# EAGLE design balancing_bot_shield (EAGLE 9.6.2)
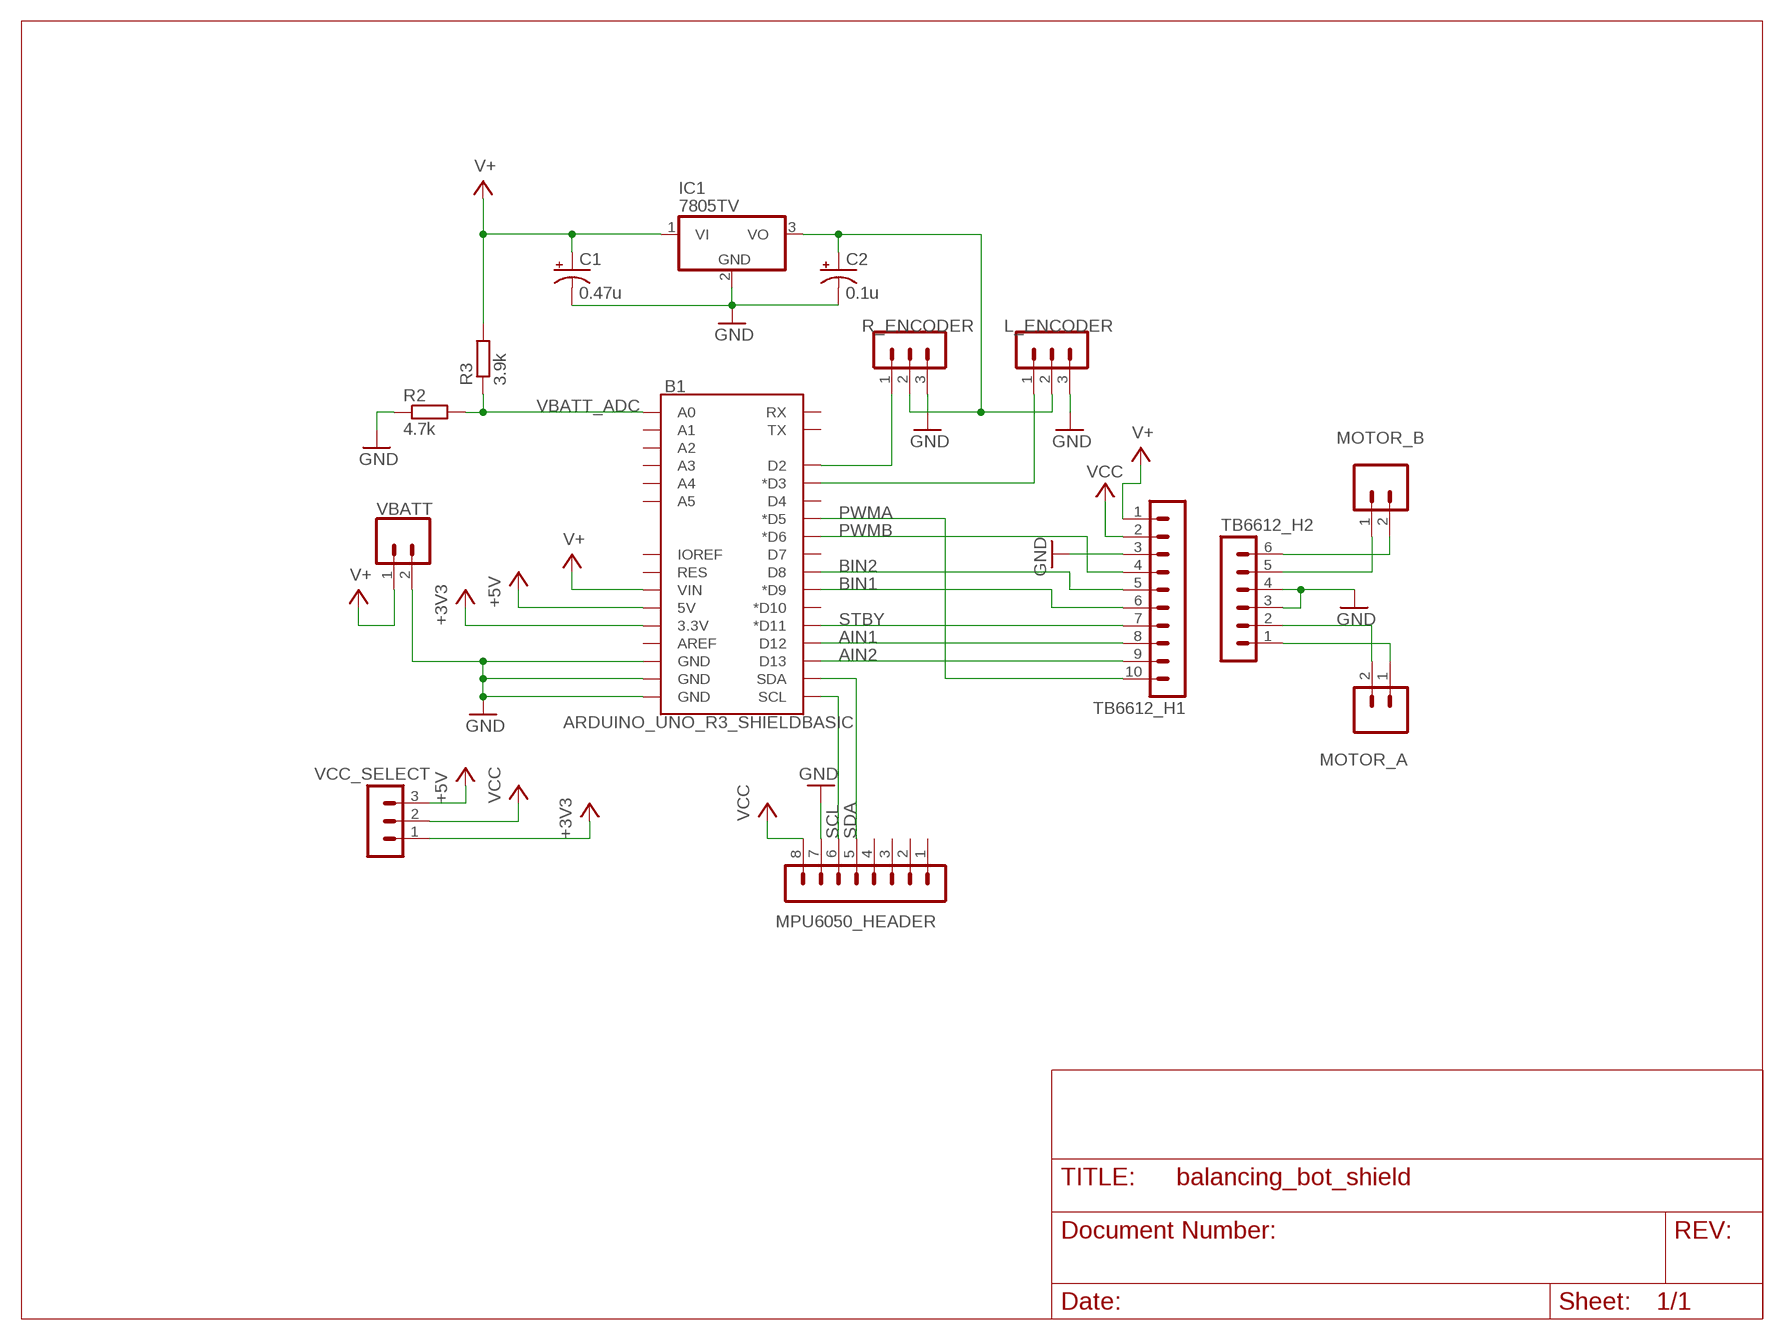
[diagram p0: schematic, sheet 1]

## Parts
B1  ARDUINO_UNO_R3_SHIELDBASIC  [UNO_R3_SHIELD]
C1  0.47u  CPOL-USE5-5  [E5-5]
C2  0.1u  CPOL-USE5-5  [E5-5]
IC1  7805TV  [TO220V]
L_ENCODER  MA03-1  [MA03-1]
MOTOR_A  CONN_025MM  [SCREWTERMINAL-5MM-2]
MOTOR_B  CONN_025MM  [SCREWTERMINAL-5MM-2]
MPU6050_HEADER  MA08-1  [MA08-1]
R2  4.7k  R-EU_0207/10  [0207/10]
R3  3.9k  R-EU_0207/10  [0207/10]
R_ENCODER  MA03-1  [MA03-1]
TB6612_H1  MA10-1  [MA10-1]
TB6612_H2  MA06-1  [MA06-1]
VBATT  CONN_025MM  [SCREWTERMINAL-5MM-2]
VCC_SELECT  MA03-1  [MA03-1]

## Nets
+3V3: B1.3.3V VCC_SELECT.1
+5V: B1.5V VCC_SELECT.3
AIN1: B1.D12 TB6612_H1.8
AIN2: B1.D13 TB6612_H1.9
BIN1: B1.D9(*D9) TB6612_H1.6
BIN2: B1.D8 TB6612_H1.5
GND: B1.GND@0(GND) B1.GND@1(GND) B1.GND@2(GND) C1.- C2.- IC1.2(GND) L_ENCODER.3 MPU6050_HEADER.7 R2.1 R_ENCODER.3 TB6612_H1.3 TB6612_H2.3 TB6612_H2.4 VBATT.2
N$1: B1.D2 R_ENCODER.1
N$2: B1.D3(*D3) L_ENCODER.1
N$3: MOTOR_B.2 TB6612_H2.6
N$4: MOTOR_B.1 TB6612_H2.5
N$5: MOTOR_A.2 TB6612_H2.2
N$6: MOTOR_A.1 TB6612_H2.1
N$7: C2.+ IC1.3(VO) L_ENCODER.2 R_ENCODER.2
PWMA: B1.D5(*D5) TB6612_H1.10
PWMB: B1.D6(*D6) TB6612_H1.4
SCL: B1.SCL MPU6050_HEADER.6
SDA: B1.SDA MPU6050_HEADER.5
STBY: B1.D11(*D11) TB6612_H1.7
V+: B1.VIN C1.+ IC1.1(VI) R3.2 TB6612_H1.1 VBATT.1
VBATT_ADC: B1.A0 R2.2 R3.1
VCC: MPU6050_HEADER.8 TB6612_H1.2 VCC_SELECT.2
Unconnected: B1.A1 B1.A2 B1.A3 B1.A4 B1.A5 B1.AREF B1.D4 B1.D7 B1.D10(*D10) B1.IOREF B1.RES B1.RX B1.TX MPU6050_HEADER.1 MPU6050_HEADER.2 MPU6050_HEADER.3 MPU6050_HEADER.4

## Library data of the parts
B1 = SparkFun-Boards:ARDUINO_UNO_R3_SHIELD: Arduino R3 Shield Footprint Shield form compatible with the Arduino Uno R3. SparkFun Products: MG2639 Cellular Shield <https://www.sparkfun.com/products/13120> MIDI Shield <https://www.sparkfun.com/products/12898> R3 Stackable Headers Kit <https://www.sparkfun.com/products/11417>
C1 C2 = rcl:CPOL-US: POLARIZED CAPACITOR, American symbol; SPICEPREFIX: C
IC1 = linear:78*: Positive VOLTAGE REGULATOR Source: http://cache.national.com/ds/LM/LM78L05.pdf http://www.fairchildsemi.com/ds/LM/LM7805.pdf
L_ENCODER R_ENCODER VCC_SELECT = con-lstb:MA03-1: PIN HEADER; OC_FARNELL: unknown; OC_NEWARK: unknown
MOTOR_A MOTOR_B VBATT = SparkFun-Connectors:CONN_02: Multi connection point. Often used as Generic Header-pin footprint for 0.1 inch spaced/style header connections On any of the 0.1 inch spaced packages, you can populate with these: Break Away Headers - Straight <https://www.sparkfun.com/products/116> (PRT-00116) Break Away Male Headers - Right Angle <https://www.sparkfun.com/products/553> (PRT-00553) Female Headers <https://www.sparkfun.com/products/115> (PRT-00115) Break Away Headers - Machine Pin <https://www.sparkfun.com/products/117> (PRT-00117) Break Away Female Headers - Swiss Machine Pin <https://www.sparkfun.com/products/743> (PRT-00743) For SCREWTERMINALS and SPRING TERMINALS visit here: Screw Terimnals on SparkFun.com <https://www.sparkfun.com/search/results?term=Screw+Terminals> (5mm/3.5mm/2.54mm spacing) This device is also useful as a general connection point to wire up your design to another part of your project. Our various solder wires solder well into these plated through hole pads. Hook-Up Wire - Assortment (Stranded, 22 AWG) <https://www.sparkfun.com/products/11375> (PRT-11375) Hook-Up Wire - Assortment (Solid Core, 22 AWG) <https://www.sparkfun.com/products/11367> (PRT-11367) View the entire wire category on our website here <https://www.sparkfun.com/categories/141> Special notes: Molex polarized connector foot print use with: PRT-08233 with associated crimp pins and housings. 2.54_SCREWTERM for use with PRT-10571. 3.5mm Screw Terminal footprints for PRT-08084 5mm Screw Terminal footprints for use with PRT-08432; SF_SKU: PRT-08432
MPU6050_HEADER = con-lstb:MA08-1: PIN HEADER; OC_FARNELL: unknown; OC_NEWARK: unknown
R2 R3 = rcl:R-EU_: RESISTOR, European symbol; SPICEPREFIX: R
TB6612_H1 = con-lstb:MA10-1: PIN HEADER; OC_FARNELL: unknown; OC_NEWARK: unknown
TB6612_H2 = con-lstb:MA06-1: PIN HEADER; OC_FARNELL: unknown; OC_NEWARK: unknown

## Board
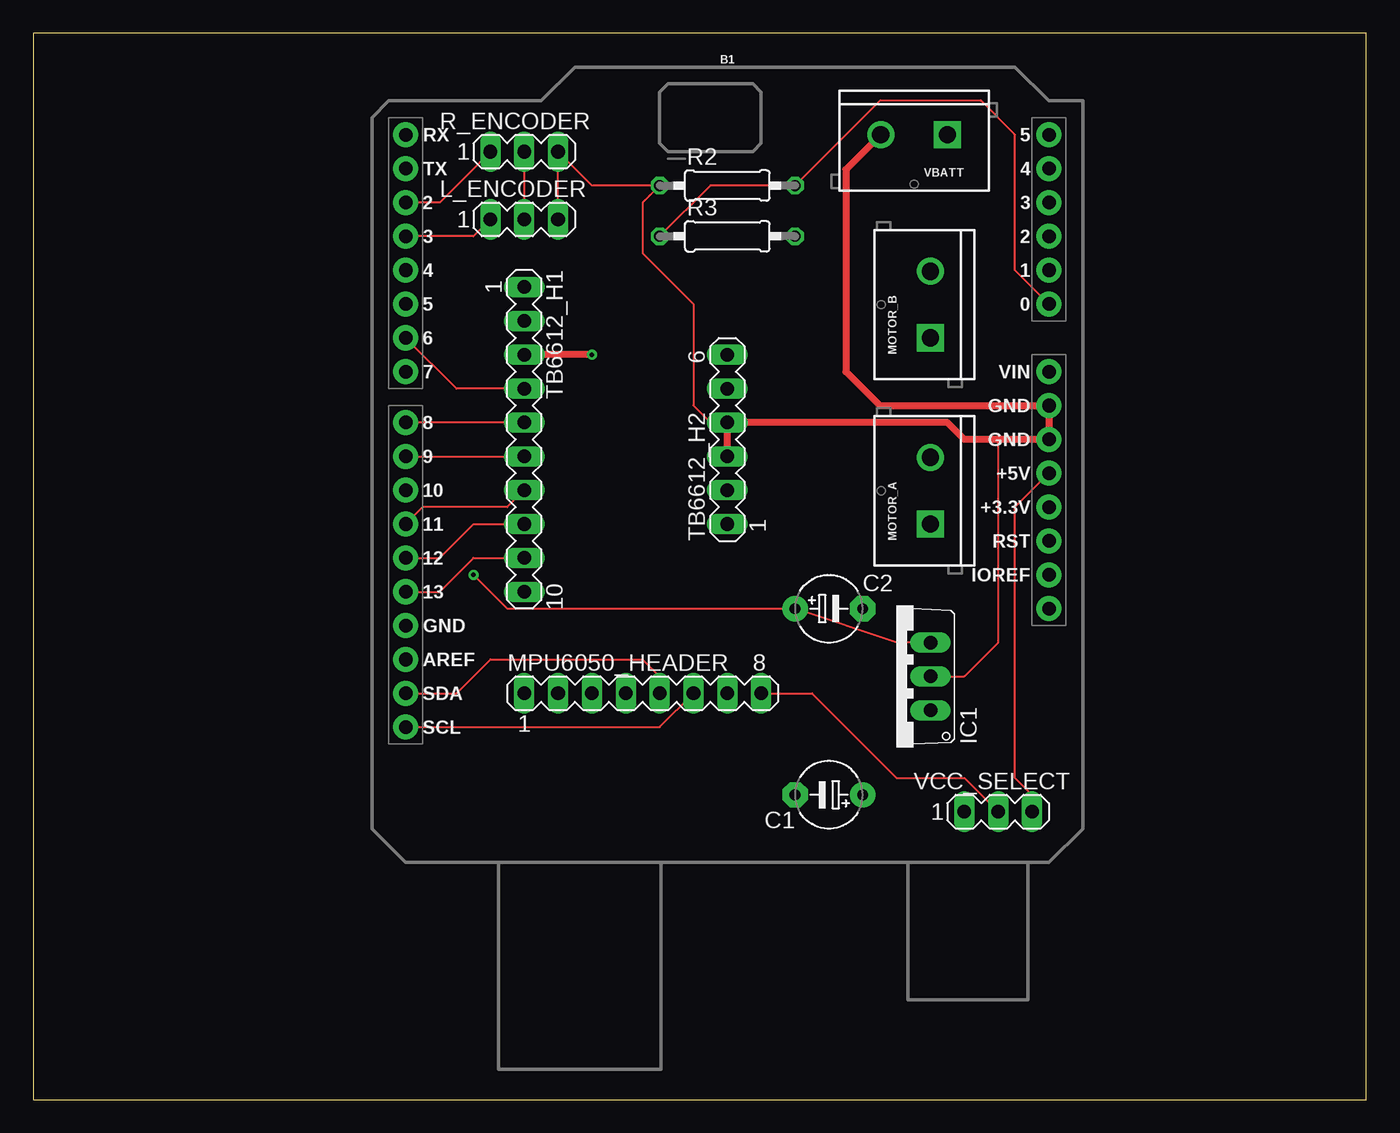
[diagram p1: board, top side]
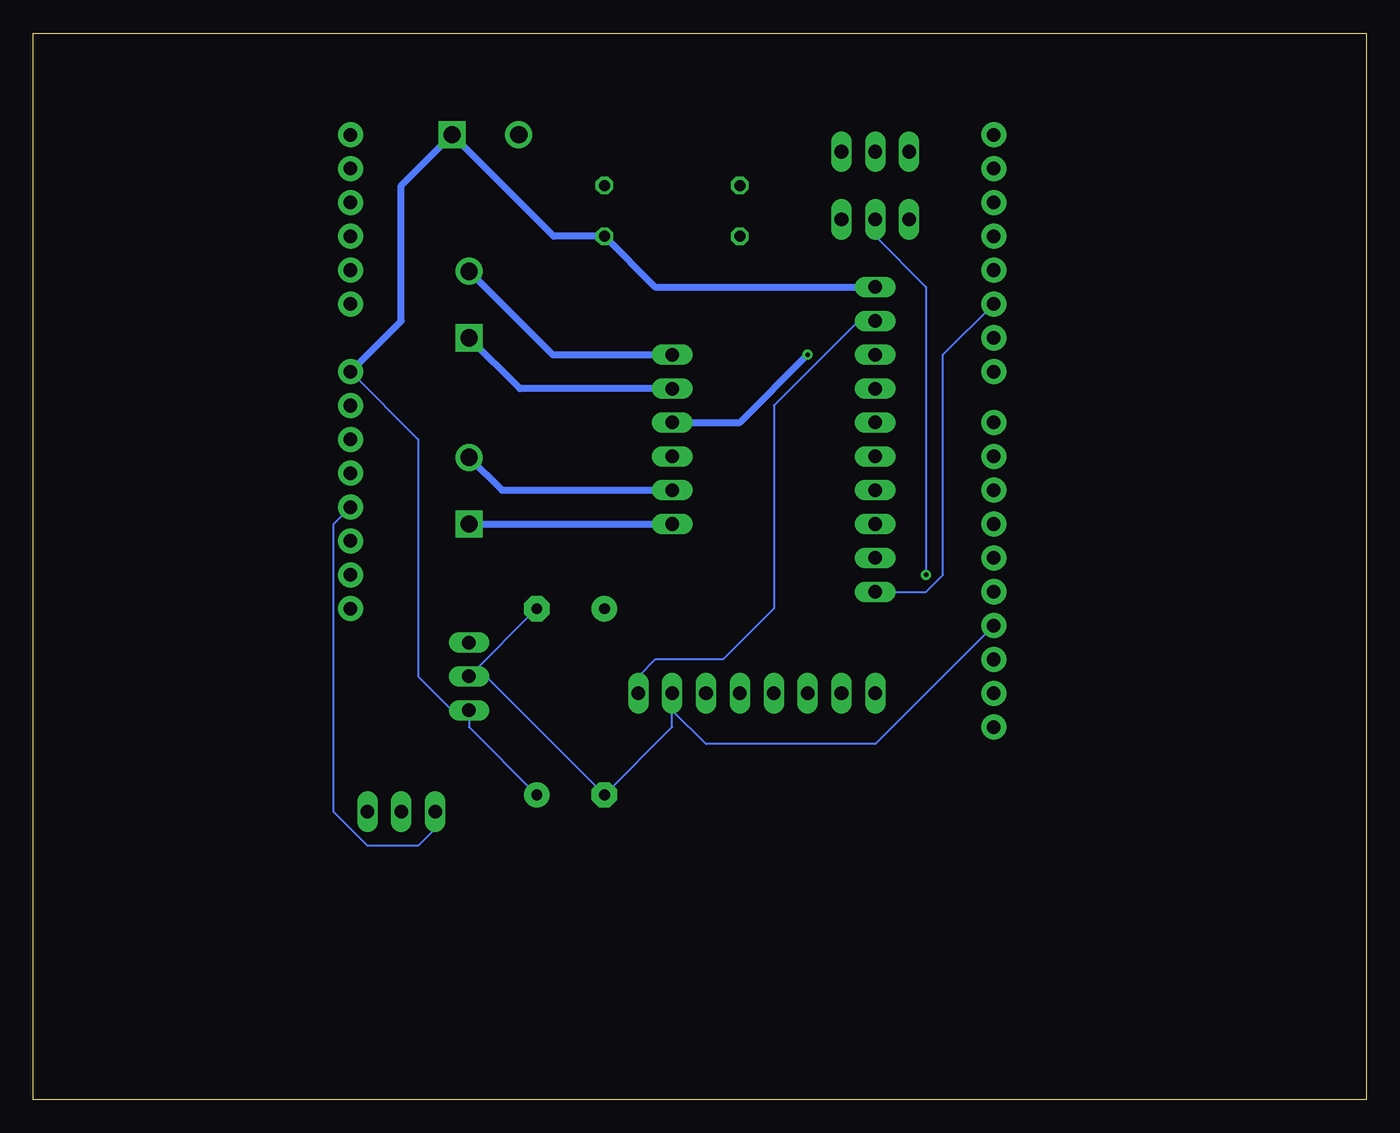
[diagram p2: board, bottom side, seen from below]

Size 100 x 80 mm. Coordinates in mm from the lower left corner, seen from the top.
Outline: 0,0 100,0 100,80 0,80 0,0
Copper layers (1*16): Top 0.035mm / dielectric 1.5mm / Bottom 0.035mm
Design rules "default": minimum track width 6mil, minimum drill 0.35mm, track to track 6mil, track to pad 6mil, pad to pad 6mil, via to via 6mil, smd to smd 6mil, copper to edge 40mil, drill to drill 6mil, minimum pad ring 10mil, minimum via ring 8mil, stop-mask expansion 4mil, vias tented up to drill 0mil, thermal gap 10mil

### Footprints (pad centres in the part's own frame; a part is rotated, then mirrored left to right if it is on the bottom)
UNO_R3_SHIELD = drill 1.016 pad 1.88: 3.3V 24.13,-2.54; 5V 24.13,0; A0 24.13,12.7; A1 24.13,15.24; A2 24.13,17.78; A3 24.13,20.32; A4 24.13,22.86; A5 24.13,25.4; AREF -24.13,-13.97; D2 -24.13,20.32; D3 -24.13,17.78; D4 -24.13,15.24; D5 -24.13,12.7; D6 -24.13,10.16; D7 -24.13,7.62; D8 -24.13,3.81; D9 -24.13,1.27; D10 -24.13,-1.27; D11 -24.13,-3.81; D12 -24.13,-6.35; D13 -24.13,-8.89; GND@0 24.13,2.54; GND@1 24.13,5.08; GND@2 -24.13,-11.43; IOREF 24.13,-7.62; NC 24.13,-10.16; RES 24.13,-5.08; RX -24.13,25.4; SCL -24.13,-19.05; SDA -24.13,-16.51; TX -24.13,22.86; VIN 24.13,7.62
E5-5 = drill 0.813 pad 1.905: + -2.54,0 | drill 0.813 pad 1.905 octagon: - 2.54,0
TO220V = drill 1.016 long: 1 -2.54,-2.54; 2 0,-2.54; 3 2.54,-2.54
MA03-1 = drill 1.016 long: 1 -2.54,0; 2 0,0; 3 2.54,0
SCREWTERMINAL-5MM-2 = drill 1.3 pad 2.032 square: 1 0,0 | drill 1.3 pad 2.032: 2 5,0
MA08-1 = drill 1.016 long: 1 -8.89,0; 2 -6.35,0; 3 -3.81,0; 4 -1.27,0; 5 1.27,0; 6 3.81,0; 7 6.35,0; 8 8.89,0
0207/10 = drill 0.813 octagon: 1 -5.08,0; 2 5.08,0
MA10-1 = drill 1.016 long: 1 -11.43,0; 2 -8.89,0; 3 -6.35,0; 4 -3.81,0; 5 -1.27,0; 6 1.27,0; 7 3.81,0; 8 6.35,0; 9 8.89,0; 10 11.43,0
MA06-1 = drill 1.016 long: 1 -6.35,0; 2 -3.81,0; 3 -1.27,0; 4 1.27,0; 5 3.81,0; 6 6.35,0

### Placement (x,y rotation side)
B1  52.07,46.99 0 top
C1  59.69,22.86 180 top
C2  59.69,36.83 0 top
IC1  64.77,31.75 90 top
L_ENCODER  36.83,66.04 0 top
MOTOR_A  67.31,43.18 90 top
MOTOR_B  67.31,57.15 90 top
MPU6050_HEADER  45.72,30.48 0 top
R2  52.07,68.58 0 top
R3  52.07,64.77 0 top
R_ENCODER  36.83,71.12 0 top
TB6612_H1  36.83,49.53 270 top
TB6612_H2  52.07,49.53 90 top
VBATT  68.58,72.39 180 top
VCC_SELECT  72.39,21.59 0 top

### Tracks (layer width: path | path; a pad name or v marks a point on that pad's centre or on a via)
+3V3
  Bottom 0.152: VCC_SELECT.1 69.85,20.32 71.12,19.05 74.93,19.05 77.47,21.59 77.47,43.18 B1.3.3V
+5V
  Top 0.152: VCC_SELECT.3 74.93,22.86 73.66,24.13 73.66,44.45 B1.5V
AIN1
  Top 0.152: B1.D12 30.48,40.64 33.02,43.18 TB6612_H1.8
AIN2
  Top 0.152: B1.D13 30.48,38.1 33.02,40.64 TB6612_H1.9
BIN1
  Top 0.152: B1.D9 TB6612_H1.6
BIN2
  Top 0.152: TB6612_H1.5 B1.D8
GND  (via drill 0.35)
  Top 0.152: TB6612_H2.4 50.8,50.8 49.53,52.07 49.53,59.69 45.72,63.5 45.72,67.31 R2.1 41.91,68.58 R_ENCODER.3 L_ENCODER.3 | IC1.2 69.85,31.75 72.39,34.29 72.39,49.53
  Top 0.508: 57.15,50.8 TB6612_H2.4 | TB6612_H2.3 TB6612_H2.4 | v41.91,55.88 TB6612_H1.3 | TB6612_H2.4 68.58,50.8 69.85,49.53 72.39,49.53 B1.GND@0 B1.GND@1 63.5,52.07 60.96,54.61 60.96,69.77 VBATT.2
  Bottom 0.152: B1.GND@2 36.83,26.67 49.53,26.67 52.07,29.21 MPU6050_HEADER.7 52.07,27.94 C1.- 66.04,31.75 IC1.2 C2.-
  Bottom 0.508: TB6612_H2.4 46.99,50.8 v41.91,55.88
N$1
  Top 0.152: R_ENCODER.1 30.48,67.31 B1.D2
N$2
  Top 0.152: L_ENCODER.1 33.02,64.77 B1.D3
N$3
  Bottom 0.508: MOTOR_B.2 61.04,55.88 TB6612_H2.6
N$4
  Bottom 0.508: TB6612_H2.5 63.5,53.34 MOTOR_B.1
N$5
  Bottom 0.508: MOTOR_A.2 64.85,45.72 TB6612_H2.2
N$6
  Bottom 0.508: MOTOR_A.1 TB6612_H2.1
N$7  (via drill 0.35)
  Top 0.152: R_ENCODER.2 L_ENCODER.2 | IC1.3 64.77,34.29 C2.+ 35.56,36.83 v33.02,39.37
  Bottom 0.152: L_ENCODER.2 36.83,64.77 33.02,60.96 v33.02,39.37
PWMA
  Bottom 0.152: TB6612_H1.10 33.02,38.1 31.75,39.37 31.75,55.88 B1.D5
PWMB
  Top 0.152: B1.D6 31.75,53.34 TB6612_H1.4
SCL
  Top 0.152: B1.SCL 46.99,27.94 MPU6050_HEADER.6
SDA
  Top 0.152: B1.SDA 31.75,30.48 34.29,33.02 45.72,33.02 46.99,31.75 MPU6050_HEADER.5
STBY
  Top 0.152: TB6612_H1.7 35.56,44.45 29.21,44.45 B1.D11
V+
  Bottom 0.152: B1.VIN 71.12,49.53 71.12,31.75 68.58,29.21 IC1.1 67.31,27.94 C1.+
  Bottom 0.508: TB6612_H1.1 53.34,60.96 R3.2 60.96,64.77 VBATT.1 72.39,68.58 72.39,58.42 B1.VIN
VBATT_ADC
  Top 0.152: R3.1 50.8,68.58 R2.2 63.5,74.93 71.12,74.93 73.66,72.39 73.66,62.23 B1.A0
VCC
  Top 0.152: MPU6050_HEADER.8 58.42,30.48 64.77,24.13 69.85,24.13 VCC_SELECT.2
  Bottom 0.152: TB6612_H1.2 38.1,58.42 44.45,52.07 44.45,36.83 48.26,33.02 53.34,33.02 54.61,31.75 MPU6050_HEADER.8